# EAGLE design levelshifter (EAGLE 4.16)
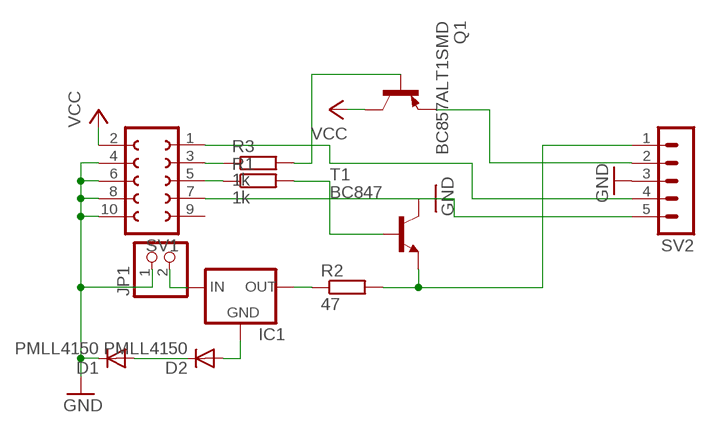
[diagram p0: schematic, sheet 1]

## Parts
D1  PMLL4150  [SOD80C]
D2  PMLL4150  [SOD80C]
IC1  78LXX  [78LXX]
JP1  PINHD-1X2  [1X02]
Q1  BC857ALT1SMD  [SOT23-BEC]
R1  1k  R-EU_R0805  [R0805]
R2  47  R-EU_R0805  [R0805]
R3  1k  R-EU_R0805  [R0805]
SV1  FE05-2W  [FE05-2W]
SV2  MA05-1  [MA05-1]
T1  BC847  [SOT23]

## Nets
GND: D1.C JP1.1 SV1.4 SV1.6 SV1.8 SV1.10 SV2.3 T1.3(C)
N$1: D1.A D2.C
N$2: R3.1 SV1.3
N$3: Q1.B R3.2
N$4: SV1.7 SV2.5
N$5: SV1.1 SV2.4
N$6: R1.1 SV1.5
N$8: D2.A IC1.GND
N$9: IC1.IN JP1.2
N$10: Q1.E SV2.2
N$11: R1.2 T1.1(B)
N$12: IC1.OUT R2.1
N$13: R2.2 SV2.1 T1.2(E)
VCC: Q1.C SV1.2
Unconnected: SV1.9

## Library data of the parts
D1 D2 = diode-1:PMLL4150: DIODE high speed
IC1 = v-reg:78LXX: VOLTAGE REGULATOR
JP1 = pinhead:PINHD-1X2: PIN HEADER
Q1 = transistor-pnp:BC857*: PNP Transistror
R1-R3 = rcl:R-EU_: RESISTOR, European symbol
SV1 = con-lsta:FE05-2W: FEMALE HEADER
SV2 = con-lstb:MA05-1: PIN HEADER
T1 = transistor:BC847: NPN TRANSISTOR

## Board
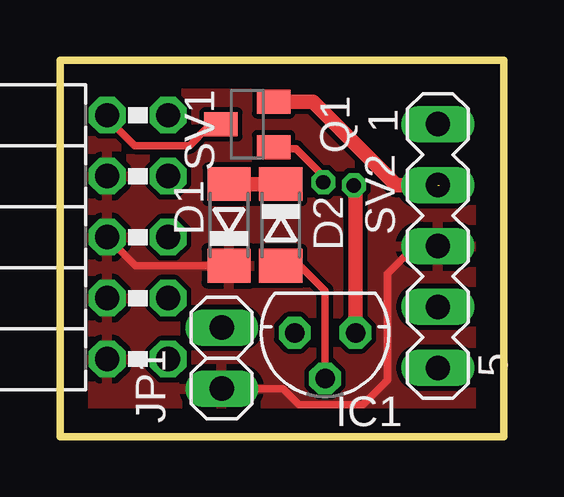
[diagram p1: board, top side]
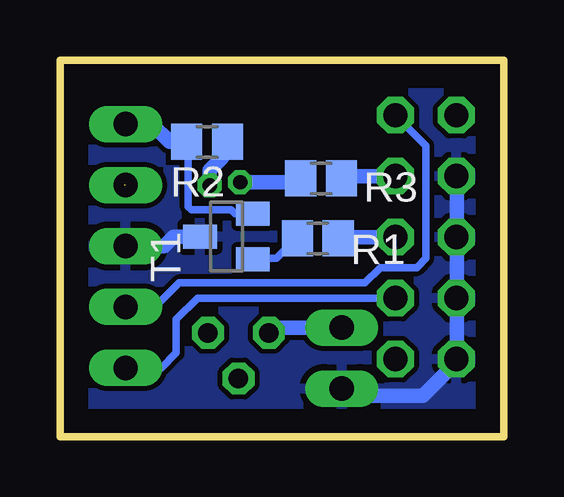
[diagram p2: board, bottom side, seen from below]

Size 18.5 x 15.7 mm. Coordinates in mm from the lower left corner, seen from the top.
Outline: 0,15.7 18.5,15.7 18.5,0 0,0 0,15.7
Copper layers (1*16): Top 0.035mm / dielectric 1.5mm / Bottom 0.035mm
Design rules "default": minimum track width 10mil, minimum drill 24mil, track to track 8mil, track to pad 8mil, pad to pad 8mil, via to via 8mil, smd to smd 8mil, copper to edge 40mil, drill to drill 8mil, minimum pad ring 10mil, minimum via ring 8mil, stop-mask expansion 4mil, vias tented up to drill 0mil, thermal gap 10mil

### Footprints (pad centres in the part's own frame; a part is rotated, then mirrored left to right if it is on the bottom)
SOD80C = smd 1.4 x 1.8: A 1.7,0; C -1.7,0
78LXX = drill 0.813 octagon: GND 0,1.905; IN 1.27,0; OUT -1.27,0
1X02 = drill 1.016 long: 1 -1.27,0; 2 1.27,0
SOT23-BEC = smd 1 x 1.4: B -0.95,-1.1; C 0,1.1; E 0.95,-1.1
R0805 = smd 1.3 x 1.5: 1 -0.85,0; 2 0.85,0
FE05-2W = drill 1.016 octagon: 1 -5.08,1.27; 2 -5.08,-1.27; 3 -2.54,1.27; 4 -2.54,-1.27; 5 0,1.27; 6 0,-1.27; 7 2.54,1.27; 8 2.54,-1.27; 9 5.08,1.27; 10 5.08,-1.27
MA05-1 = drill 1.016 long: 1 -5.08,0; 2 -2.54,0; 3 0,0; 4 2.54,0; 5 5.08,0
SOT23 = smd 1 x 1.4: 1 -0.95,-1.1; 2 0.95,-1.1; 3 0,1.1

### Placement (x,y rotation side)
D1  7.05,8.83 90 top
D2  9.21,8.83 270 top
IC1  11.06,4.33 180 top
JP1  6.74,3.28 90 top
Q1  7.81,13.02 90 top
R1  7.75,8.27 180 bottom
R2  12.36,12.29 180 bottom
R3  7.61,10.77 180 bottom
SV1  3.24,8.32 270 top
SV2  15.76,7.95 270 top
T1  11.56,8.34 90 bottom

### Tracks (layer width: path | path; a pad name or v marks a point on that pad's centre or on a via)
GND
  Top 0.305: D1.C 3.16,7.13 SV1.6 | JP1.1 9.29,2.01 9.97,1.33 12.64,1.33 13.65,2.35 13.65,6.8 14.8,7.94 15.69,7.94 15.7,7.95 SV2.3
  Bottom 0.305: 15.69,7.94 15.7,7.95 SV2.3
  Bottom 0.406: 1.95,8.2 1.95,8.32 SV1.6 | 1.95,10.86 SV1.4 | 1.95,5.45 1.95,5.78 SV1.8 | 1.95,2.95 1.95,3.24 SV1.10
  Bottom 0.61: 1.95,10.86 1.95,8.32 1.95,5.78 1.95,3.24 | T1.3 13.76,8.34 14.16,7.94 15.69,7.94 | JP1.1 6.46,2.01 6.16,1.72 3.37,1.72 1.97,3.11 SV1.10
  pour Bottom: 0,15.7 18.5,15.7 18.5,0 0,0 0,15.6
  pour Top: 0,15.7 18.5,15.7 18.5,0.1 18.5,0 0,0
N$1
  Top 0.305: D2.C 9.29,10.53 9.34,10.48
  Top 0.61: D1.A 9.29,10.53
N$2
  Bottom 0.406: 6.95,10.7 6.95,10.77 | 6.95,10.77 R3.1 | 6.95,10.86 6.95,10.77
  Bottom 0.61: SV1.3 6.95,10.86
N$3  (via drill 0.6)
  Top 0.305: v10.99,10.61 10.99,10.86 9.84,12 9.08,12 8.96,12.13 8.91,12.09 Q1.B
  Bottom 0.305: 8.83,10.61 8.66,10.77 R3.2
  Bottom 0.61: 8.83,10.61 v10.99,10.61
N$4
  Bottom 0.305: 4.38,5.78 SV1.7 12.76,5.78 13.65,4.89 13.65,3.49 14.29,2.86 15.69,2.86 15.7,2.87 SV2.5
N$5
  Bottom 0.305: SV1.1 3.24,12.13 3.24,7.43 3.62,7.05 5.15,7.05 5.78,6.42 13.53,6.42 14.54,5.4 15.69,5.4 15.7,5.41 SV2.4
N$6
  Bottom 0.406: 6.95,8.2 6.95,8.27 | 6.95,8.27 R1.1 | 6.95,8.32 6.95,8.27
  Bottom 0.61: SV1.5 6.95,8.32
N$8
  Top 0.305: IC1.GND 11.06,6.09 10.1,7.05 9.21,7.05 9.13,7.13 | 9.08,7.18 9.13,7.13 | 9.13,7.13 D2.A
N$9
  Bottom 0.61: IC1.IN 9.77,4.33 9.55,4.55 JP1.2
N$10  (2 unrouted)
  Top 0.305: Q1.E 9.27,13.97
  Top 0.61: 9.27,13.97 10.54,13.97 14.04,10.48 15.69,10.48 15.7,10.49 SV2.2
N$11
  Bottom 0.305: R1.2 8.62,8.27 9.46,7.43 10.73,7.43 10.7,7.4 T1.1
N$12  (via drill 0.6)
  Top 0.305: 12.33,10.41 v12.26,10.48
  Top 0.61: IC1.OUT 12.33,10.41
  Bottom 0.305: 11.62,12.26 11.59,12.29 R2.1 11.51,12.28 11.49,12.26 11.75,12
  Bottom 0.61: v12.26,10.48 12.26,11.11 11.75,11.62 11.75,11.88 11.49,12.13 11.51,12.15 R2.1
N$13
  Bottom 0.305: T1.2 11.2,9.29 11.37,9.46 13.02,9.46 13.15,9.59 13.15,12.13 13.27,12.26 13.24,12.29 R2.2 | 15.69,13.02 15.7,13.03 SV2.1
  Bottom 0.61: R2.2 13.94,12.29 14.67,13.02 15.69,13.02
VCC
  Top 0.305: SV1.2 1.97,13.27 3.11,12.13 5.4,12.13 6.16,12.89 6.42,12.89 6.54,13.02 Q1.C